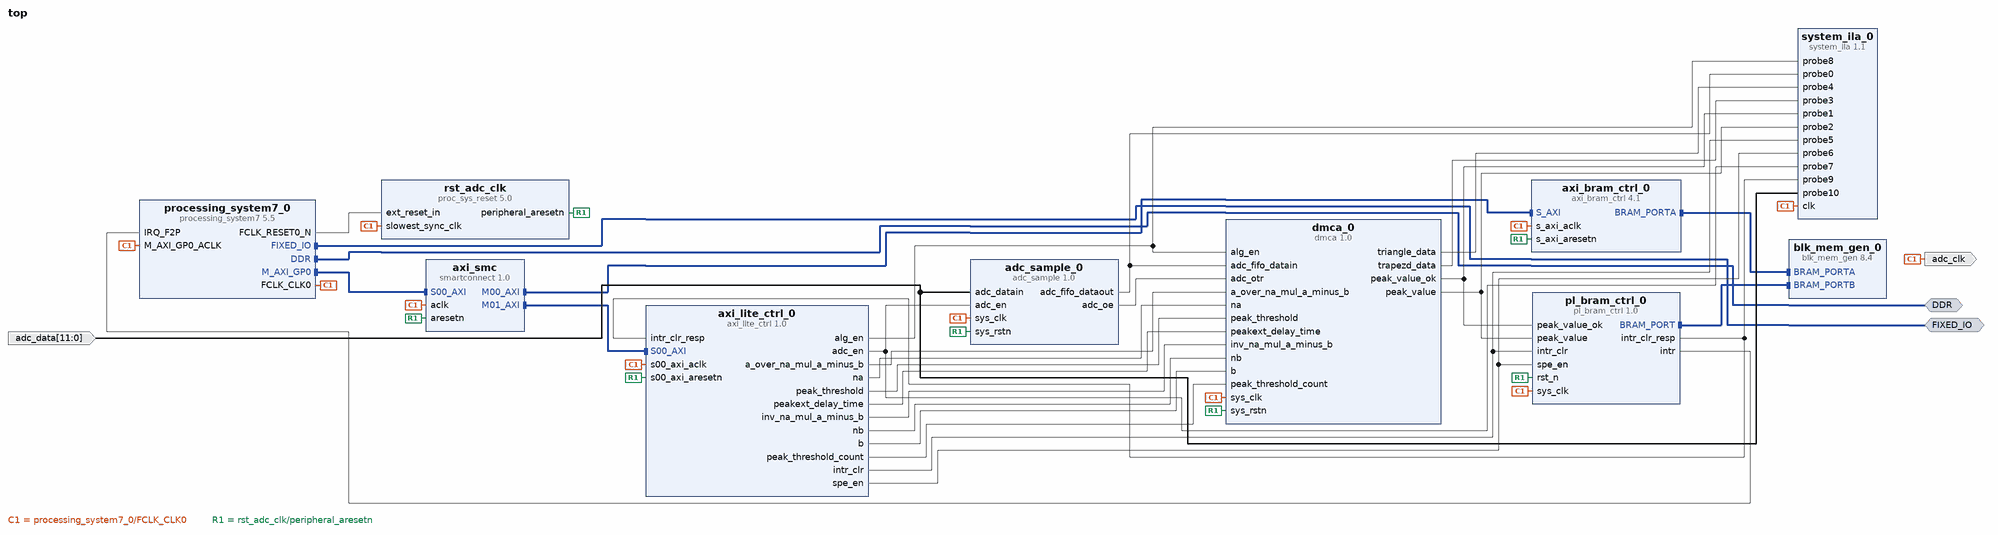
[diagram p0: block diagram of the top level]
# Vivado block design top, xc7z020clg400-2, Vivado 2018.3
create_bd_design top

create_bd_intf_port -mode Master -vlnv xilinx.com:interface:ddrx_rtl:1.0 DDR
create_bd_intf_port -mode Master -vlnv xilinx.com:display_processing_system7:fixedio_rtl:1.0 FIXED_IO
create_bd_port -dir I -from 11 -to 0 adc_data
create_bd_port -dir O -type clk adc_clk

create_bd_cell -type ip -vlnv xilinx.com:ip:processing_system7:5.5 processing_system7_0
set_property -dict [list \
  CONFIG.PCW_APU_PERIPHERAL_FREQMHZ 666.666666 \
  CONFIG.PCW_CPU_CPU_6X4X_MAX_RANGE 767 \
  CONFIG.PCW_ENET0_ENET0_IO {MIO 16 .. 27} \
  CONFIG.PCW_ENET0_GRP_MDIO_ENABLE 1 \
  CONFIG.PCW_ENET0_GRP_MDIO_IO {MIO 52 .. 53} \
  CONFIG.PCW_ENET0_PERIPHERAL_ENABLE 1 \
  CONFIG.PCW_ENET0_RESET_ENABLE 0 \
  CONFIG.PCW_ENET_RESET_ENABLE 1 \
  CONFIG.PCW_ENET_RESET_SELECT {Share reset pin} \
  CONFIG.PCW_FPGA0_PERIPHERAL_FREQMHZ 65 \
  CONFIG.PCW_FPGA1_PERIPHERAL_FREQMHZ 65 \
  CONFIG.PCW_GPIO_MIO_GPIO_ENABLE 1 \
  CONFIG.PCW_GPIO_MIO_GPIO_IO MIO \
  CONFIG.PCW_I2C0_GRP_INT_ENABLE 0 \
  CONFIG.PCW_I2C0_I2C0_IO {MIO 50 .. 51} \
  CONFIG.PCW_I2C0_PERIPHERAL_ENABLE 1 \
  CONFIG.PCW_I2C_PERIPHERAL_FREQMHZ 111.111115 \
  CONFIG.PCW_I2C_RESET_ENABLE 1 \
  CONFIG.PCW_I2C_RESET_SELECT {Share reset pin} \
  CONFIG.PCW_IRQ_F2P_INTR 1 \
  CONFIG.PCW_PERIPHERAL_BOARD_PRESET None \
  CONFIG.PCW_PRESET_BANK1_VOLTAGE {LVCMOS 1.8V} \
  CONFIG.PCW_QSPI_GRP_FBCLK_ENABLE 1 \
  CONFIG.PCW_QSPI_GRP_FBCLK_IO {MIO 8} \
  CONFIG.PCW_QSPI_GRP_SINGLE_SS_ENABLE 1 \
  CONFIG.PCW_QSPI_GRP_SINGLE_SS_IO {MIO 1 .. 6} \
  CONFIG.PCW_QSPI_PERIPHERAL_ENABLE 1 \
  CONFIG.PCW_QSPI_QSPI_IO {MIO 1 .. 6} \
  CONFIG.PCW_SD0_GRP_CD_ENABLE 1 \
  CONFIG.PCW_SD0_GRP_CD_IO {MIO 47} \
  CONFIG.PCW_SD0_GRP_WP_ENABLE 0 \
  CONFIG.PCW_SD0_PERIPHERAL_ENABLE 1 \
  CONFIG.PCW_SD0_SD0_IO {MIO 40 .. 45} \
  CONFIG.PCW_SDIO_PERIPHERAL_FREQMHZ 100 \
  CONFIG.PCW_SINGLE_QSPI_DATA_MODE x4 \
  CONFIG.PCW_UART1_PERIPHERAL_ENABLE 1 \
  CONFIG.PCW_UART1_UART1_IO {MIO 48 .. 49} \
  CONFIG.PCW_UART_PERIPHERAL_FREQMHZ 100 \
  CONFIG.PCW_UIPARAM_DDR_FREQ_MHZ 533.333333 \
  CONFIG.PCW_UIPARAM_DDR_PARTNO {MT41J256M16 RE-125} \
  CONFIG.PCW_USB0_PERIPHERAL_ENABLE 1 \
  CONFIG.PCW_USB0_RESET_ENABLE 1 \
  CONFIG.PCW_USB0_RESET_IO {MIO 46} \
  CONFIG.PCW_USB0_USB0_IO {MIO 28 .. 39} \
  CONFIG.PCW_USB_RESET_ENABLE 1 \
  CONFIG.PCW_USB_RESET_SELECT {Share reset pin} \
  CONFIG.PCW_USE_FABRIC_INTERRUPT 1 \
] [get_bd_cells processing_system7_0]
# 516 more settings of processing_system7_0 are not shown: defaults, MIO pin electricals, DDR timing, and values the tool derives
create_bd_cell -type ip -vlnv xilinx.com:ip:axi_bram_ctrl:4.1 axi_bram_ctrl_0
set_property -dict {CONFIG.SINGLE_PORT_BRAM 1} [get_bd_cells axi_bram_ctrl_0]
create_bd_cell -type ip -vlnv xilinx.com:ip:smartconnect:1.0 axi_smc
set_property -dict {CONFIG.NUM_MI 2 CONFIG.NUM_SI 1} [get_bd_cells axi_smc]
create_bd_cell -type ip -vlnv xilinx.com:ip:blk_mem_gen:8.4 blk_mem_gen_0
set_property -dict [list \
  CONFIG.EN_SAFETY_CKT false \
  CONFIG.Enable_32bit_Address true \
  CONFIG.Enable_B Use_ENB_Pin \
  CONFIG.Memory_Type True_Dual_Port_RAM \
  CONFIG.Port_B_Clock 100 \
  CONFIG.Port_B_Enable_Rate 100 \
  CONFIG.Port_B_Write_Rate 50 \
  CONFIG.Register_PortA_Output_of_Memory_Primitives false \
  CONFIG.Register_PortB_Output_of_Memory_Primitives false \
  CONFIG.Use_RSTA_Pin true \
  CONFIG.Use_RSTB_Pin true \
  CONFIG.use_bram_block BRAM_Controller \
] [get_bd_cells blk_mem_gen_0]
create_bd_cell -type ip -vlnv xilinx.com:ip:proc_sys_reset:5.0 rst_adc_clk
create_bd_cell -type ip -vlnv xilinx.com:user:axi_lite_ctrl:1.0 axi_lite_ctrl_0
create_bd_cell -type ip -vlnv xilinx.com:ip:system_ila:1.1 system_ila_0
set_property -dict [list \
  CONFIG.C_DATA_DEPTH 4096 \
  CONFIG.C_MON_TYPE NATIVE \
  CONFIG.C_NUM_MONITOR_SLOTS 1 \
  CONFIG.C_NUM_OF_PROBES 11 \
  CONFIG.C_PROBE10_TYPE 0 \
  CONFIG.C_SLOT_0_INTF_TYPE xilinx.com:interface:bram_rtl:1.0 \
  CONFIG.C_SLOT_0_TYPE 0 \
] [get_bd_cells system_ila_0]
create_bd_cell -type ip -vlnv xilinx.com:user:pl_bram_ctrl:1.0 pl_bram_ctrl_0
create_bd_cell -type ip -vlnv xilinx.com:user:adc_sample:1.0 adc_sample_0
create_bd_cell -type ip -vlnv xilinx.com:user:dmca:1.0 dmca_0

# ---- connections ----

connect_bd_intf_net [get_bd_intf_pins axi_smc/M00_AXI] [get_bd_intf_pins axi_bram_ctrl_0/S_AXI]
connect_bd_intf_net [get_bd_intf_ports FIXED_IO] [get_bd_intf_pins processing_system7_0/FIXED_IO]
connect_bd_intf_net [get_bd_intf_pins blk_mem_gen_0/BRAM_PORTA] [get_bd_intf_pins axi_bram_ctrl_0/BRAM_PORTA]
connect_bd_intf_net [get_bd_intf_pins axi_smc/M01_AXI] [get_bd_intf_pins axi_lite_ctrl_0/S00_AXI]
connect_bd_intf_net [get_bd_intf_ports DDR] [get_bd_intf_pins processing_system7_0/DDR]
connect_bd_intf_net [get_bd_intf_pins pl_bram_ctrl_0/BRAM_PORT] [get_bd_intf_pins blk_mem_gen_0/BRAM_PORTB]
connect_bd_intf_net [get_bd_intf_pins processing_system7_0/M_AXI_GP0] [get_bd_intf_pins axi_smc/S00_AXI]
connect_bd_net [get_bd_pins processing_system7_0/FCLK_CLK0] \
  [get_bd_ports adc_clk] [get_bd_pins rst_adc_clk/slowest_sync_clk] [get_bd_pins processing_system7_0/M_AXI_GP0_ACLK] \
  [get_bd_pins axi_bram_ctrl_0/s_axi_aclk] [get_bd_pins axi_smc/aclk] [get_bd_pins axi_lite_ctrl_0/s00_axi_aclk] \
  [get_bd_pins system_ila_0/clk] [get_bd_pins pl_bram_ctrl_0/sys_clk] [get_bd_pins adc_sample_0/sys_clk] \
  [get_bd_pins dmca_0/sys_clk]
connect_bd_net [get_bd_pins processing_system7_0/FCLK_RESET0_N] [get_bd_pins rst_adc_clk/ext_reset_in]
connect_bd_net [get_bd_pins axi_lite_ctrl_0/alg_en] [get_bd_pins system_ila_0/probe8] [get_bd_pins dmca_0/alg_en]
connect_bd_net [get_bd_pins dmca_0/peak_value_ok] [get_bd_pins system_ila_0/probe1] [get_bd_pins pl_bram_ctrl_0/peak_value_ok]
connect_bd_net [get_bd_pins dmca_0/peak_value] [get_bd_pins system_ila_0/probe2] [get_bd_pins pl_bram_ctrl_0/peak_value]
connect_bd_net [get_bd_pins rst_adc_clk/peripheral_aresetn] \
  [get_bd_pins axi_bram_ctrl_0/s_axi_aresetn] [get_bd_pins axi_smc/aresetn] [get_bd_pins axi_lite_ctrl_0/s00_axi_aresetn] \
  [get_bd_pins pl_bram_ctrl_0/rst_n] [get_bd_pins adc_sample_0/sys_rstn] [get_bd_pins dmca_0/sys_rstn]
connect_bd_net [get_bd_pins pl_bram_ctrl_0/intr] [get_bd_pins processing_system7_0/IRQ_F2P]
connect_bd_net -net axi_lite_ctrl_0_spe_intr_clr [get_bd_pins axi_lite_ctrl_0/intr_clr] \
  [get_bd_pins system_ila_0/probe5] [get_bd_pins pl_bram_ctrl_0/intr_clr]
connect_bd_net [get_bd_pins axi_lite_ctrl_0/adc_en] [get_bd_pins system_ila_0/probe7] [get_bd_pins adc_sample_0/adc_en]
connect_bd_net [get_bd_pins adc_sample_0/adc_fifo_dataout] [get_bd_pins system_ila_0/probe0] [get_bd_pins dmca_0/adc_fifo_datain]
connect_bd_net [get_bd_pins axi_lite_ctrl_0/spe_en] [get_bd_pins system_ila_0/probe6] [get_bd_pins pl_bram_ctrl_0/spe_en]
connect_bd_net -net adc_data_1 [get_bd_ports adc_data] [get_bd_pins system_ila_0/probe10] [get_bd_pins adc_sample_0/adc_datain]
connect_bd_net [get_bd_pins pl_bram_ctrl_0/intr_clr_resp] [get_bd_pins axi_lite_ctrl_0/intr_clr_resp] [get_bd_pins system_ila_0/probe9]
connect_bd_net -net triangle_data [get_bd_pins dmca_0/triangle_data] [get_bd_pins system_ila_0/probe4]
connect_bd_net [get_bd_pins adc_sample_0/adc_oe] [get_bd_pins dmca_0/adc_otr]
connect_bd_net [get_bd_pins axi_lite_ctrl_0/a_over_na_mul_a_minus_b] [get_bd_pins dmca_0/a_over_na_mul_a_minus_b]
connect_bd_net [get_bd_pins axi_lite_ctrl_0/na] [get_bd_pins dmca_0/na]
connect_bd_net [get_bd_pins axi_lite_ctrl_0/peak_threshold] [get_bd_pins dmca_0/peak_threshold]
connect_bd_net -net trapezd_data [get_bd_pins dmca_0/trapezd_data] [get_bd_pins system_ila_0/probe3]
connect_bd_net [get_bd_pins axi_lite_ctrl_0/peakext_delay_time] [get_bd_pins dmca_0/peakext_delay_time]
connect_bd_net [get_bd_pins axi_lite_ctrl_0/inv_na_mul_a_minus_b] [get_bd_pins dmca_0/inv_na_mul_a_minus_b]
connect_bd_net [get_bd_pins axi_lite_ctrl_0/nb] [get_bd_pins dmca_0/nb]
connect_bd_net [get_bd_pins axi_lite_ctrl_0/b] [get_bd_pins dmca_0/b]
connect_bd_net [get_bd_pins axi_lite_ctrl_0/peak_threshold_count] [get_bd_pins dmca_0/peak_threshold_count]
set_property HDL_ATTRIBUTE.BMM_INFO_PROCESSOR {arm > top axi_bram_ctrl_0} [get_bd_cells processing_system7_0]
set_property HDL_ATTRIBUTE.KEEP_HIERARCHY yes [get_bd_cells processing_system7_0]
set_property HDL_ATTRIBUTE.BMM_INFO_ADDRESS_SPACE {byte  0x40000000 32 > top blk_mem_gen_0} [get_bd_cells axi_bram_ctrl_0]
set_property HDL_ATTRIBUTE.KEEP_HIERARCHY yes [get_bd_cells axi_bram_ctrl_0]
set_property HDL_ATTRIBUTE.DEBUG true [get_bd_nets adc_data_1]
set_property HDL_ATTRIBUTE.MARK_DEBUG true [get_bd_nets adc_data_1]

# ---- address map ----
assign_bd_address -offset 0x40000000 -range 16K -target_address_space [get_bd_addr_spaces processing_system7_0/Data] [get_bd_addr_segs axi_bram_ctrl_0/S_AXI/Mem0]
assign_bd_address -offset 0x43C00000 -range 64K -target_address_space [get_bd_addr_spaces processing_system7_0/Data] [get_bd_addr_segs axi_lite_ctrl_0/S00_AXI/S00_AXI_reg]

validate_bd_design
save_bd_design
